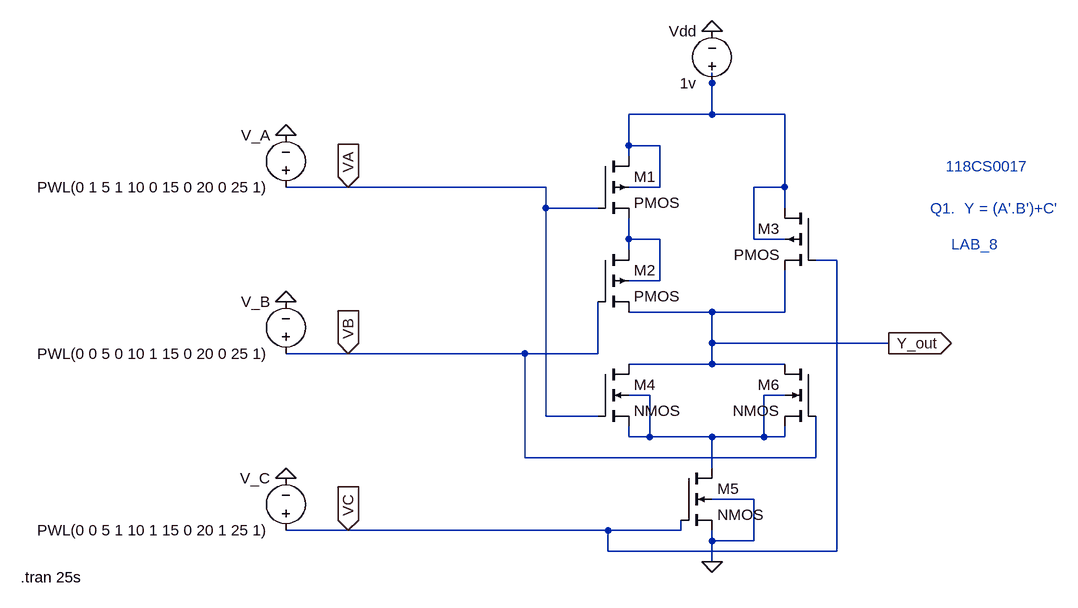
[diagram p0: schematic Draft17.asc]
Draft17.asc, the LTspice schematic file:
Version 4
SHEET 1 880 788
WIRE 256 -64 256 -80
WIRE 256 -16 256 -64
WIRE 256 -16 128 -16
WIRE 368 -16 256 -16
WIRE 128 32 128 -16
WIRE 176 32 128 32
WIRE 128 48 128 32
WIRE -304 96 -400 96
WIRE 0 96 -304 96
WIRE 176 96 176 32
WIRE 176 96 128 96
WIRE 368 96 368 -16
WIRE 368 96 320 96
WIRE 0 128 0 96
WIRE 80 128 0 128
WIRE 368 128 368 96
WIRE 128 176 128 144
WIRE 176 176 128 176
WIRE 320 176 320 96
WIRE 368 176 320 176
WIRE 128 192 128 176
WIRE 448 208 416 208
WIRE 176 240 176 176
WIRE 176 240 128 240
WIRE 256 288 128 288
WIRE 368 288 368 224
WIRE 368 288 256 288
WIRE 256 336 256 288
WIRE 528 336 256 336
WIRE -304 352 -400 352
WIRE -32 352 -304 352
WIRE 80 352 80 272
WIRE 80 352 -32 352
WIRE 256 368 256 336
WIRE 256 368 128 368
WIRE 368 368 256 368
WIRE 160 416 128 416
WIRE 368 416 336 416
WIRE 0 448 0 128
WIRE 80 448 0 448
WIRE 128 480 128 464
WIRE 160 480 160 416
WIRE 160 480 128 480
WIRE 256 480 160 480
WIRE 336 480 336 416
WIRE 336 480 256 480
WIRE 368 480 368 464
WIRE 368 480 336 480
WIRE -32 512 -32 352
WIRE 416 512 416 448
WIRE 416 512 -32 512
WIRE 256 528 256 480
WIRE 320 576 256 576
WIRE -304 624 -400 624
WIRE 96 624 -304 624
WIRE 208 624 208 608
WIRE 208 624 96 624
WIRE 256 640 256 624
WIRE 320 640 320 576
WIRE 320 640 256 640
WIRE 96 656 96 624
WIRE 448 656 448 208
WIRE 448 656 96 656
WIRE 256 672 256 640
FLAG 256 -144 0
FLAG 256 672 0
FLAG 528 336 Y_out
IOPIN 528 336 Out
FLAG -400 16 0
FLAG -400 272 0
FLAG -400 544 0
FLAG -304 96 VA
IOPIN -304 96 In
FLAG -304 352 VB
IOPIN -304 352 In
FLAG -304 624 VC
IOPIN -304 624 In
SYMBOL pmos4 80 48 R0
SYMATTR InstName M1
SYMBOL pmos4 80 192 R0
SYMATTR InstName M2
SYMBOL pmos4 416 128 M0
SYMATTR InstName M3
SYMBOL voltage 256 -48 R180
WINDOW 0 24 96 Left 2
WINDOW 3 24 16 Left 2
SYMATTR InstName Vdd
SYMATTR Value 1v
SYMBOL nmos4 80 368 R0
SYMATTR InstName M4
SYMBOL nmos4 208 528 R0
SYMATTR InstName M5
SYMBOL nmos4 416 368 M0
SYMATTR InstName M6
SYMBOL voltage -400 640 R180
WINDOW 0 24 96 Left 2
WINDOW 3 24 16 Left 2
WINDOW 123 0 0 Left 0
WINDOW 39 0 0 Left 0
SYMATTR InstName V_C
SYMATTR Value PWL(0 0 5 1 10 1 15 0 20 1 25 1)
SYMBOL voltage -400 368 R180
WINDOW 0 24 96 Left 2
WINDOW 3 24 16 Left 2
WINDOW 123 0 0 Left 0
WINDOW 39 0 0 Left 0
SYMATTR InstName V_B
SYMATTR Value PWL(0 0 5 0 10 1 15 0 20 0 25 1)
SYMBOL voltage -400 112 R180
WINDOW 0 24 96 Left 2
WINDOW 3 24 16 Left 2
WINDOW 123 0 0 Left 0
WINDOW 39 0 0 Left 0
SYMATTR InstName V_A
SYMATTR Value PWL(0 1 5 1 10 0 15 0 20 0 25 1)
TEXT -808 696 Left 2 !.tran 25s
TEXT 616 64 Left 2 ;118CS0017
TEXT 592 128 Left 2 ;Q1.  Y = (A'.B')+C'
TEXT 624 184 Left 2 ;LAB_8

The netlist it stands for:
* Draft17.asc
M1 N001 VA N002 N001 PMOS
M2 N002 VB Y_out N002 PMOS
M3 N001 VC Y_out N001 PMOS
Vdd N001 0 1v
M4 Y_out VA N003 N003 NMOS
M5 N003 VC 0 0 NMOS
M6 Y_out VB N003 N003 NMOS
V_C VC 0 PWL(0 0 5 1 10 1 15 0 20 1 25 1)
V_B VB 0 PWL(0 0 5 0 10 1 15 0 20 0 25 1)
V_A VA 0 PWL(0 1 5 1 10 0 15 0 20 0 25 1)
.model NMOS NMOS
.model PMOS PMOS
.lib standard.mos
.tran 25s
* 118CS0017
* Q1.  Y = (A'.B')+C'
* LAB_8
.backanno
.end